# Altium schematic sheet LOGIC_MCU.SchDoc: MCU Logic
size B; Engineer: M. Jones; Organization: Michael Jones; DocumentNumber: 5; Revision: RA.1; SheetNumber: 5; SheetTotal: 7
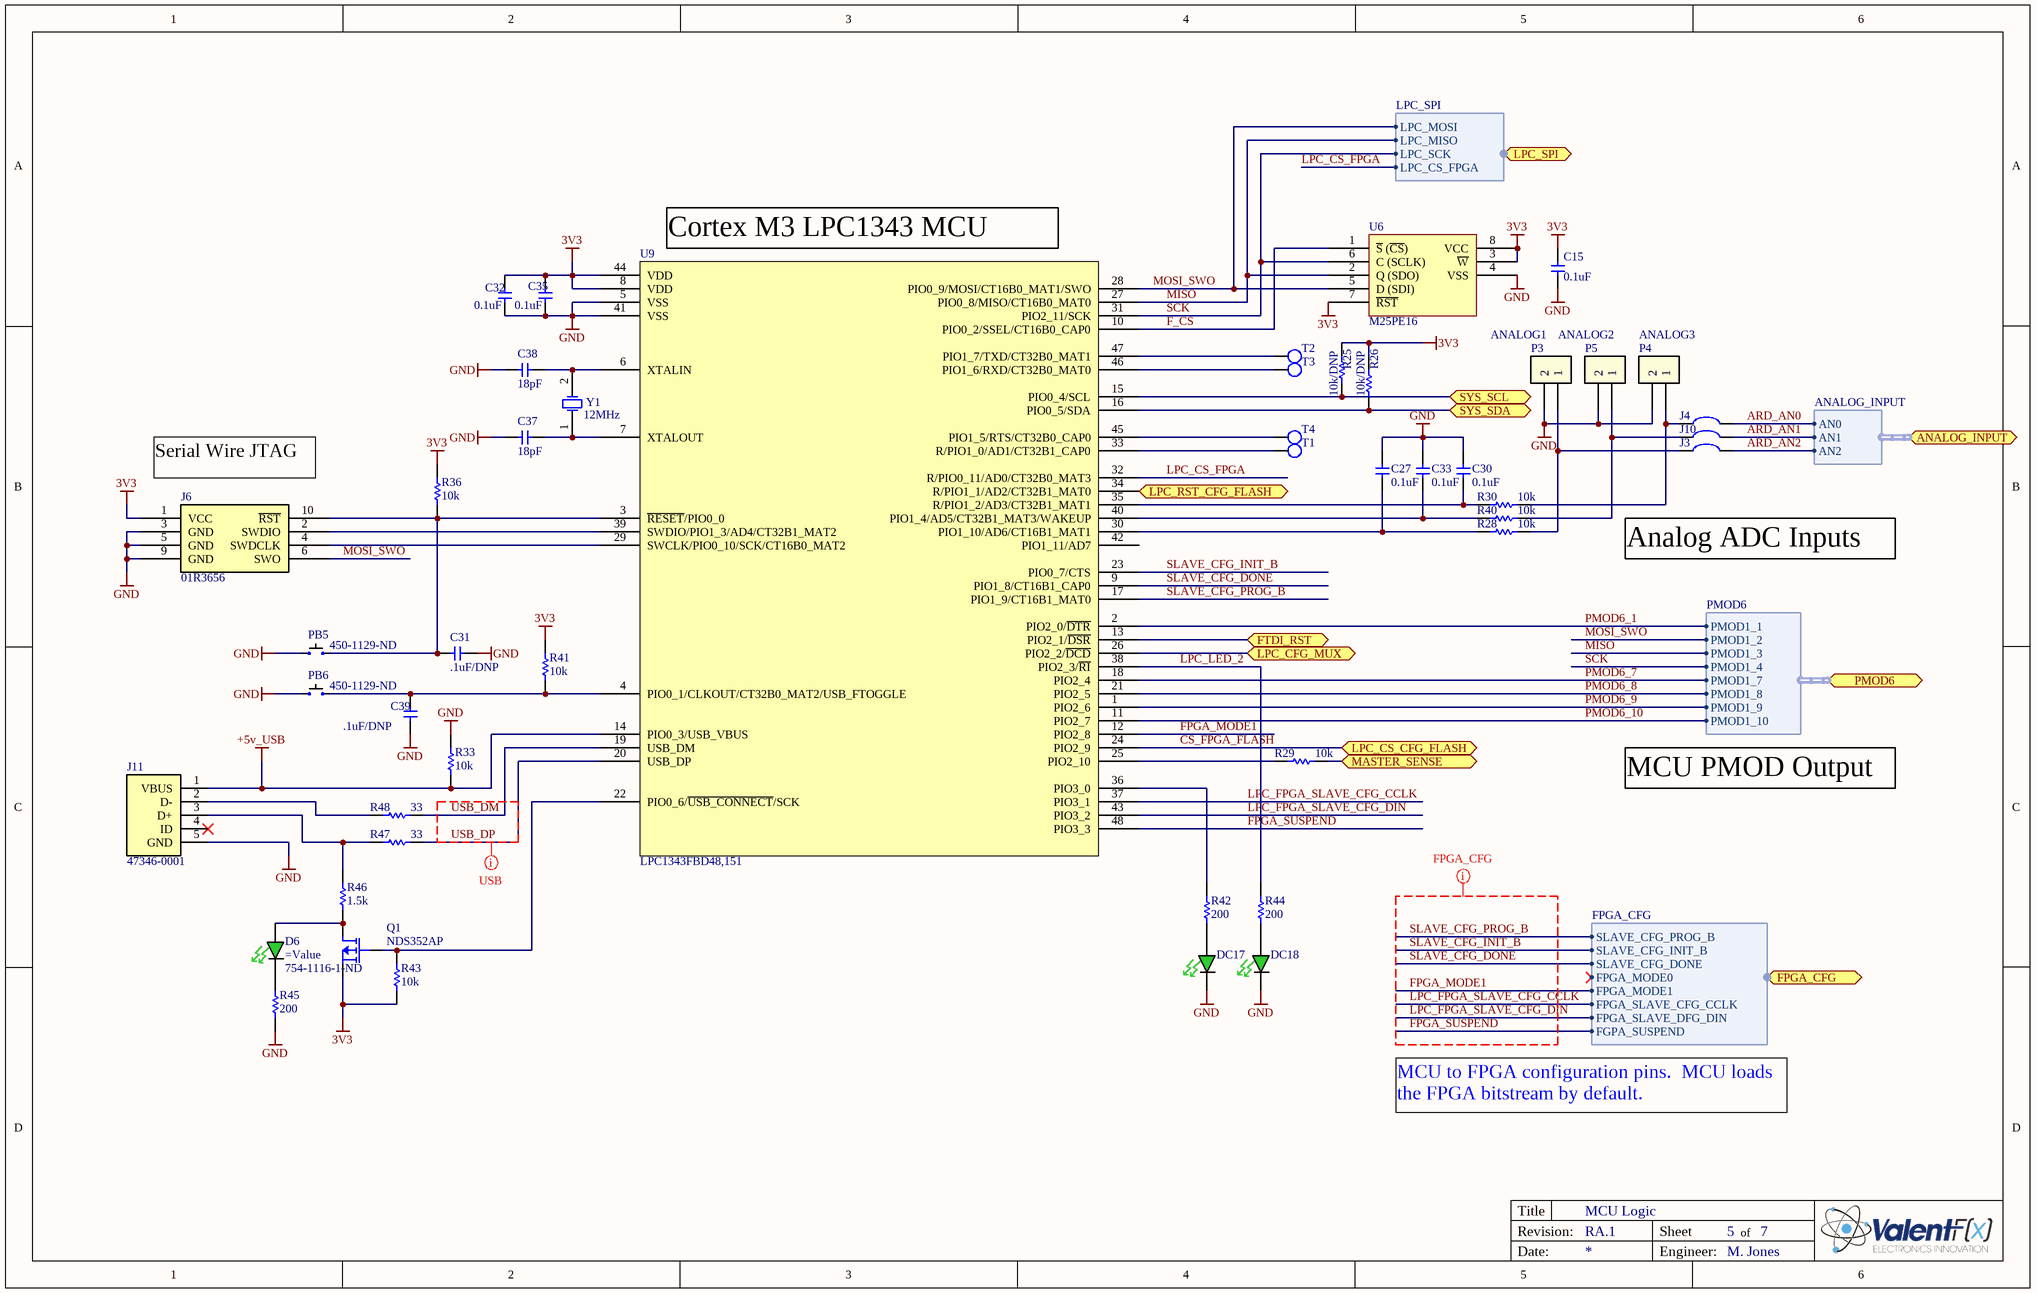
[diagram p0: LOGIC_MCU.SchDoc]

## Parts
C15  0.1uF  [C0603]
C27  0.1uF  [C0603]
C30  0.1uF  [C0603]
C31  .1uF/DNP  [C0603]
C32  0.1uF  [C0603]
C33  0.1uF  [C0603]
C35  0.1uF  [C0603]
C37  18pF  [C0603]
C38  18pF  [C0603]
C39  .1uF/DNP  [C0603]
D6  Supplier Part Number 1: 754-1116-1-ND  [LED_0603 - GREEN]
DC17  (no value)  [LED_0603 - GREEN]
DC18  (no value)  [LED_0603 - GREEN]
J3  Solder Jumper  [SOLDER_JUMPER SMALL 2]  (value not drawn)
J4  Solder Jumper  [SOLDER_JUMPER SMALL 2]  (value not drawn)
J6  01R3656  [FTSH-105-04-F-DV]
J10  Solder Jumper  [SOLDER_JUMPER SMALL 2]  (value not drawn)
J11  47346-0001  [USB - 47346-0001]
P3  ANALOG1  [HEADER_2_30_100 THRU SIP]
P4  ANALOG3  [HEADER_2_30_100 THRU SIP]
P5  ANALOG2  [HEADER_2_30_100 THRU SIP]
PB5  Supplier Part Number 1: 450-1129-ND  [FSM4JSMA]
PB6  Supplier Part Number 1: 450-1129-ND  [FSM4JSMA]
Q1  NDS352AP  [SOT-23]
R25  value 10k/DNP  [R0603]  (hidden comment: 10k)
R26  value 10k/DNP  [R0603]  (hidden comment: 10k)
R28  10k  [R0603]
R29  10k  [R0603]
R30  10k  [R0603]
R33  10k  [R0603]
R36  10k  [R0603]
R40  10k  [R0603]
R41  10k  [R0603]
R42  200  [R0603]
R43  10k  [R0603]
R44  200  [R0603]
R45  200  [R0603]
R46  1.5k  [R0603]
R47  33  [R0603]
R48  33  [R0603]
T1  Test Point  [tp 18-28]  (value not drawn)
T2  Test Point  [tp 18-28]  (value not drawn)
T3  Test Point  [tp 18-28]  (value not drawn)
T4  Test Point  [tp 18-28]  (value not drawn)
U6  M25PE16  [SOIC127P830X200-8L]
U9  LPC1343FBD48,151  [TSQFP50P900X900X145-48L]
Y1  12MHz  [ABM3]

## Ports
ANALOG_INPUT (harness ANALOG_INPUT), FPGA_CFG (harness FPGA_CFG), FTDI_RST, LPC_CFG_MUX, LPC_CS_CFG_FLASH, LPC_RST_CFG_FLASH, LPC_SPI (harness LPC_SPI), MASTER_SENSE, PMOD6 (harness PMOD6), SYS_SCL, SYS_SDA

## Harnesses
FPGA_CFG: SLAVE_CFG_PROG_B, SLAVE_CFG_INIT_B, SLAVE_CFG_DONE, FPGA_MODE0, FPGA_MODE1, FPGA_SLAVE_CFG_CCLK, FPGA_SLAVE_DFG_DIN, FGPA_SUSPEND
PMOD6: PMOD1_1, PMOD1_2, PMOD1_3, PMOD1_4, PMOD1_7, PMOD1_8, PMOD1_9, PMOD1_10
ANALOG_INPUT: AN0, AN1, AN2
LPC_SPI: LPC_MOSI, LPC_MISO, LPC_SCK, LPC_CS_FPGA

## Nets
3V3: C15.2 C32.2 C35.2 J6.1(VCC) Q1.2(S) R25.2 R26.2 R36.1 R41.1 R43.2 U6.3(~{W}) U6.7(~{RST}) U6.8(VCC) U9.8(VDD) U9.44(VDD)
+5v_USB: J11.1(VBUS) R33.2 U9.14(PIO0_3/USB_VBUS)
GND: C15.1 C27.2 C30.2 C31.1 C32.1 C33.2 C35.1 C37.1 C38.1 C39.1 DC17.C DC18.C J6.3(GND) J6.5(GND) J6.9(GND) J11.5(GND) P3.2 P4.2 P5.2 PB5.A PB6.A R33.1 R45.1 U6.4(VSS) U9.5(VSS) U9.41(VSS)
ARD_AN0: J4.2 ; port ANALOG_INPUT.AN0
ARD_AN1: J10.2 ; port ANALOG_INPUT.AN1
ARD_AN2: J3.2 ; port ANALOG_INPUT.AN2
CS_FPGA_FLASH: U9.24(PIO2_9) ; port LPC_CS_CFG_FLASH
F_CS: U6.1(~{S}_(~{CS})) U9.10(PIO0_2/SSEL/CT16B0_CAP0)
FPGA_MODE1: U9.12(PIO2_8) ; port FPGA_CFG.FPGA_MODE1
FPGA_SUSPEND: U9.48(PIO3_3) ; port FPGA_CFG.FGPA_SUSPEND
FTDI_RST: U9.13(PIO2_1/~{DSR}) ; port FTDI_RST
LPC_CFG_MUX: U9.26(PIO2_2/~{DCD}) ; port LPC_CFG_MUX
LPC_CS_FPGA: U9.32(R/PIO0_11/AD0/CT32B0_MAT3) ; port LPC_SPI.LPC_CS_FPGA
LPC_FPGA_SLAVE_CFG_CCLK: U9.37(PIO3_1) ; port FPGA_CFG.FPGA_SLAVE_CFG_CCLK
LPC_FPGA_SLAVE_CFG_DIN: U9.43(PIO3_2) ; port FPGA_CFG.FPGA_SLAVE_DFG_DIN
LPC_LED_2: R44.1 U9.38(PIO2_3/~{RI})
LPC_RST_CFG_FLASH: U9.34(R/PIO1_1/AD2/CT32B1_MAT0) ; port LPC_RST_CFG_FLASH
MASTER_SENSE: R29.2 ; port MASTER_SENSE
MISO: U6.2(Q_(SDO)) U9.27(PIO0_8/MISO/CT16B0_MAT0) ; port PMOD6.PMOD1_3, port LPC_SPI.LPC_MISO
MOSI_SWO: J6.6(SWO) U6.5(D_(SDI)) U9.28(PIO0_9/MOSI/CT16B0_MAT1/SWO) ; port PMOD6.PMOD1_2, port LPC_SPI.LPC_MOSI
PMOD6_1: U9.2(PIO2_0/~{DTR}) ; port PMOD6.PMOD1_1
PMOD6_7: U9.18(PIO2_4) ; port PMOD6.PMOD1_7
PMOD6_8: U9.21(PIO2_5) ; port PMOD6.PMOD1_8
PMOD6_9: U9.1(PIO2_6) ; port PMOD6.PMOD1_9
PMOD6_10: U9.11(PIO2_7) ; port PMOD6.PMOD1_10
SCK: U6.6(C_(SCLK)) U9.31(PIO2_11/SCK) ; port PMOD6.PMOD1_4, port LPC_SPI.LPC_SCK
SLAVE_CFG_DONE: U9.9(PIO1_8/CT16B1_CAP0) ; port FPGA_CFG.SLAVE_CFG_DONE
SLAVE_CFG_INIT_B: U9.23(PIO0_7/CTS) ; port FPGA_CFG.SLAVE_CFG_INIT_B
SLAVE_CFG_PROG_B: U9.17(PIO1_9/CT16B1_MAT0) ; port FPGA_CFG.SLAVE_CFG_PROG_B
SYS_SCL: R25.1 U9.15(PIO0_4/SCL) ; port SYS_SCL
SYS_SDA: R26.1 U9.16(PIO0_5/SDA) ; port SYS_SDA
USB_DM: R48.2 U9.19(USB_DM)
USB_DP: R47.2 U9.20(USB_DP)
NetC27_1: C27.1 R28.1 U9.30(PIO1_10/AD6/CT16B1_MAT1)
NetC30_1: C30.1 R30.1 U9.35(R/PIO1_2/AD3/CT32B1_MAT1)
NetC31_2: C31.2 J6.10(~{RST}) PB5.B R36.2 U9.3(~{RESET}/PIO0_0)
NetC33_1: C33.1 R40.1 U9.40(PIO1_4/AD5/CT32B1_MAT3/WAKEUP)
NetC37_2: C37.2 U9.7(XTALOUT) Y1.1(OSC1)
NetC38_2: C38.2 U9.6(XTALIN) Y1.2(OSC2)
NetC39_2: C39.2 PB6.B R41.2 U9.4(PIO0_1/CLKOUT/CT32B0_MAT2/USB_FTOGGLE)
NetD6_A: D6.A Q1.3(D) R46.1
NetD6_C: D6.C R45.2
NetDC17_A: DC17.A R42.2
NetDC18_A: DC18.A R44.2
NetJ3_1: J3.1 P3.1 R28.2
NetJ4_1: J4.1 P4.1 R30.2
NetJ6_2: J6.2(SWDIO) U9.39(SWDIO/PIO1_3/AD4/CT32B1_MAT2)
NetJ6_4: J6.4(SWDCLK) U9.29(SWCLK/PIO0_10/SCK/CT16B0_MAT2)
NetJ10_1: J10.1 P5.1 R40.2
NetJ11_2: J11.2(D-) R48.1
NetJ11_3: J11.3(D+) R46.2 R47.1
NetQ1_1: Q1.1(G) R43.1 U9.22(PIO0_6/~{USB_CON}~{NECT}/SCK)
NetR29_1: R29.1 U9.25(PIO2_10)
NetR42_1: R42.1 U9.36(PIO3_0)
NetT1_1: T1.1 U9.33(R/PIO1_0/AD1/CT32B1_CAP0)
NetT2_1: T2.1 U9.47(PIO1_7/TXD/CT32B0_MAT1)
NetT3_1: T3.1 U9.46(PIO1_6/RXD/CT32B0_MAT0)
NetT4_1: T4.1 U9.45(PIO1_5/RTS/CT32B0_CAP0)

Not connected (* = marked no-connect by the designer): J11 4(ID)*; U9 42(PIO1_11/AD7)

## Layout directives
net class FPGA_CFG: FPGA_MODE1, FPGA_SUSPEND, LPC_FPGA_SLAVE_CFG_CCLK, LPC_FPGA_SLAVE_CFG_DIN, SLAVE_CFG_DONE, SLAVE_CFG_INIT_B, SLAVE_CFG_PROG_B
net class USB: USB_DP

## Notes on the sheet
- (near U9) Cortex M3 LPC1343 MCU
- (near J6) Serial Wire JTAG
- Analog ADC Inputs
- MCU PMOD Output
- MCU to FPGA configuration pins.  MCU loads the FPGA bitstream by default.
- Title
- Revision:
- Sheet
- of
- Date:
- Engineer:

## Library data of the parts
C15 C27 C30 C32 C33 C35 = GRM188R71H104KA93D: CAP CER .1UF 50V 10% X7R 0603; Manufacturer: Murata Electronics North America; Capacitance: 0.1µF; Value: 0.1uF; Supplier 1: Digi-Key; Supplier Part Number 1: 490-1519-1-ND; Manufacturer Part Number: GRM188R71H104KA93D; RoHS: RoHS Compliant; Category: Capacitors; Stock 1: 6315460; Pricing 1: 10=0.037, 100=0.0221, 500=0.01276, 1000=0.00884 (USD); Voltage - Rated: 50V; Tolerance: ±10%; Temperature Coefficient: X7R; Mounting Type: Surface Mount, MLCC; Operating Temperature: -55°C ~ 125°C; Features: -; Applications: General Purpose; Ratings: -; Package / Case: 0603 (1608 Metric); Size / Dimension: 0.063" L x 0.031" W (1.60mm x 0.80mm); Lead Spacing: -; Thickness: 0.80mm; Packaging: Cut Tape (CT); Lead Style: -; ComponentLink1URL: http://search.murata.co.jp/Ceramy/image/img/PDF/ENG/GRM188R71H104KA93.pdf; ComponentLink1Description: http://search.murata.co.jp/Ceramy/image/img/PDF/ENG/GRM188R71H104KA93.pdf
C31 C39 = GRM188R71H104KA93D: CAP CER .1UF 50V 10% X7R 0603; Manufacturer: Murata Electronics North America; Value: 0.1uF; Capacitance: 0.1µF; Supplier 1: Digi-Key; Supplier Part Number 1: 490-1519-1-ND; Manufacturer Part Number: GRM188R71H104KA93D; RoHS: RoHS Compliant; Category: Capacitors; Stock 1: 6315460; Pricing 1: 10=0.037, 100=0.0221, 500=0.01276, 1000=0.00884 (USD); Voltage - Rated: 50V; Tolerance: ±10%; Temperature Coefficient: X7R; Mounting Type: Surface Mount, MLCC; Operating Temperature: -55°C ~ 125°C; Features: -; Applications: General Purpose; Ratings: -; Package / Case: 0603 (1608 Metric); Size / Dimension: 0.063" L x 0.031" W (1.60mm x 0.80mm); Lead Spacing: -; Thickness: 0.80mm; Packaging: Cut Tape (CT); Lead Style: -; ComponentLink1URL: http://search.murata.co.jp/Ceramy/image/img/PDF/ENG/GRM188R71H104KA93.pdf; ComponentLink1Description: http://search.murata.co.jp/Ceramy/image/img/PDF/ENG/GRM188R71H104KA93.pdf
C37 C38 = GRM1885C1H180JA01D: CAP CER 18PF 50V 5% C0G 0603; Source Part Number: 490-1409-1-ND; Manufacturer: Murata Electronics North America; Temperature Coefficient: C0G, NP0; Source: Digikey; Manufacturer Part Number: GRM1885C1H180JA01D; ROHS Certificate: *; Value: CAP CER 18PF 50V 5% C0G 0603; Supplier 1: Digi-Key; Supplier Part Number 1: 490-1409-1-ND; RoHS: RoHS Compliant; Category: Capacitors; Stock 1: 357140; Pricing 1: 10=0.037, 100=0.0221, 500=0.01276, 1000=0.00884 (USD); Capacitance: 18pF; Voltage - Rated: 50V; Tolerance: ±5%; Mounting Type: Surface Mount, MLCC; Operating Temperature: -55°C ~ 125°C; Features: -; Applications: General Purpose; Ratings: -; Package / Case: 0603 (1608 Metric); Size / Dimension: 0.063" L x 0.031" W (1.60mm x 0.80mm); Lead Spacing: -; Thickness: 0.80mm; Packaging: Cut Tape (CT); Lead Style: -; ComponentLink1URL: http://search.murata.co.jp/Ceramy/image/img/PDF/ENG/GRM1885C1H180JA01.pdf; ComponentLink1Description: http://search.murata.co.jp/Ceramy/image/img/PDF/ENG/GRM1885C1H180JA01.pdf
D6 = APT1608CGCK: LED 1.6X0.8MM 570NM GRN CLR SMD; Manufacturer: Kingbright Corp; Color: Green; Current - Test: 20mA; Wavelength - Peak: 574nm; Millicandela Rating: 50mcd; Voltage - Forward (Vf) Typ: 2.1V; Lens Type: Clear; Lens Style/Size: Rectangle with Flat Top, 1.2mm x 0.8mm; Viewing Angle: 120°; Supplier 1: Digi-Key; Manufacturer Part Number: APT1608CGCK; RoHS: RoHS Compliant; Category: Optoelectronics; Stock 1: 98122; Pricing 1: 1=0.2, 10=0.153, 25=0.1224, 100=0.1105, 250=0.102, 500=0.0918 (USD); Luminous Flux @ Current - Test: -; Wavelength - Dominant: 570nm; Size / Dimension: 1.60mm L x 0.80mm W; Height: 0.75mm; Package / Case: 0603 (1608 Metric); Mounting Type: Surface Mount; Packaging: Cut Tape (CT); ComponentLink1URL: http://www.us.kingbright.com/images/catalog/SPEC/APT1608CGCK.pdf; ComponentLink1Description: http://www.us.kingbright.com/images/catalog/SPEC/APT1608CGCK.pdf
DC17 DC18 = APT1608CGCK: LED 1.6X0.8MM 570NM GRN CLR SMD; Manufacturer: Kingbright Corp; Current - Test: 20mA; Wavelength - Peak: 574nm; Millicandela Rating: 50mcd; Voltage - Forward (Vf) Typ: 2.1V; Lens Type: Clear; Lens Style/Size: Rectangle with Flat Top, 1.2mm x 0.8mm; Viewing Angle: 120°; Supplier 1: Digi-Key; Supplier Part Number 1: 754-1116-1-ND; Manufacturer Part Number: APT1608CGCK; RoHS: RoHS Compliant; Category: Optoelectronics; Stock 1: 98122; Pricing 1: 1=0.2, 10=0.153, 25=0.1224, 100=0.1105, 250=0.102, 500=0.0918 (USD); Color: Green; Luminous Flux @ Current - Test: -; Wavelength - Dominant: 570nm; Size / Dimension: 1.60mm L x 0.80mm W; Height: 0.75mm; Package / Case: 0603 (1608 Metric); Mounting Type: Surface Mount; Packaging: Cut Tape (CT); ComponentLink1URL: http://www.us.kingbright.com/images/catalog/SPEC/APT1608CGCK.pdf; ComponentLink1Description: http://www.us.kingbright.com/images/catalog/SPEC/APT1608CGCK.pdf
J3 J4 J10 = Solder Jumper: Solder/Configuration Jumper; Manufacturer: n/a; Manufacturer Part Number: n/a; Source: n/a; Source Part Number: n/a; ROHS Certificate: n/a
J6 = Cortex SWD  Connector: Cortex SWD Connector; Manufacturer: SAMTEC; Description: SAMTEC - FTSH-105-04-F-DV - .050 X .050; Supplier 1: Newark; Supplier Part Number 1: 01R3656; Manufacturer Part Number: FTSH-105-04-F-DV; Category: Connectors; Stock 1: 0; Pricing 1: 1=0.871, 25000=0.754, 50000=0.705 (USD); Value: 01R3656
J11 = USB - 0473460001: Micro B CONN RCPT 5POS MICRO B USB R/A; Manufacturer: Molex Inc; Description: CONN RCPT 5POS MICRO USB R/A; Connector Type: USB - micro B; Number of Contacts: 5; Gender: Receptacle; Supplier 1: Digi-Key; Manufacturer Part Number: 0473460001; RoHS: RoHS Compliant; Category: Connectors, Interconnects; Stock 1: 2501; Pricing 1: 1=1, 10=0.877, 25=0.8252, 50=0.7906, 100=0.7563, 250=0.68752, 500=0.61876, 1000=0.55 (USD); Specifications: -; Mounting Type: Surface Mount, Right Angle, Horizontal; Features: Shielded; Packaging: Cut Tape (CT); Ingress Protection: -; ComponentLink1URL: http://www.molex.com/pdm_docs/sd/473460001_sd.pdf; ComponentLink1Description: http://www.molex.com/pdm_docs/sd/473460001_sd.pdf; Supplier Part Number 1: WM17141CT-ND; Value: 47346-0001
P3-P5 = Header2: Header 2 pin
PB5 PB6 = FSM4JSMATR: SWITCH TACTILE SPST-NO 0.05A 12V; Manufacturer: TE Connectivity; Switch Function: Off-Mom; Contact Rating @ Voltage: 0.05A @ 12VDC; Actuator Type: Standard; Outline: 6.00mm x 6.00mm; Illumination: Non-Illuminated; Operating Force: 160gf; Actuator Height off PCB, from Pins: 5.00mm; Actuator Orientation: Top Actuated; Actuator Material: Polyphenylene Sulfide (PPS); Switch Travel: 0.25mm; Mechanical Life: 100,000 Cycles; Supplier 1: Digi-Key; Manufacturer Part Number: FSM4JSMA; RoHS: RoHS Compliant; Category: Switches; Stock 1: 13038; Pricing 1: 1=0.26, 10=0.246, 25=0.2096, 50=0.1834, 100=0.1703, 250=0.15064, 500=0.1441, 1000=0.1179, 5000=0.09825 (USD); Circuit: SPST-NO; Mounting Type: Surface Mount; Termination Style: Gull Wing; Packaging: Bulk; ComponentLink1URL: http://www.te.com/commerce/DocumentDelivery/DDEController?Action=srchrtrv&DocNm=2-1437565-7&DocType=Customer+Drawing&DocLang=English; ComponentLink1Description: http://www.te.com/commerce/DocumentDelivery/DDEController?Action=srchrtrv&DocNm=2-1437565-7&DocType=Customer+Drawing&DocLang=English; Illumination Voltage (Nominal): -; Illumination Type, Color: -; Ingress Protection: -; Features: -; Operating Temperature: -35°C ~ 85°C
Q1 = NDS352AP: MOSFET P-CH 30V 900MA SSOT3; Manufacturer: Fairchild Semiconductor; FET Type: MOSFET P-Channel, Metal Oxide; FET Feature: Logic Level Gate; Rds On (Max) @ Id, Vgs: 300 mOhm @ 1A, 10V; Vgs(th) (Max) @ Id: 2.5V @ 250µA; Gate Charge (Qg) @ Vgs: 3nC @ 4.5V; Input Capacitance (Ciss) @ Vds: 135pF @ 15V; Power - Max: 460mW; Value: NDS352AP; Supplier 1: Digi-Key; Supplier Part Number 1: NDS352APCT-ND; Manufacturer Part Number: NDS352AP; RoHS: RoHS Compliant; Category: Discrete Semiconductor Products; Stock 1: 165125; Pricing 1: 1=0.61, 10=0.485, 100=0.364, 250=0.31436, 500=0.27024, 750=0.23163, 1000=0.20957, 2000=0.19303 (USD); Drain to Source Voltage (Vdss): 30V; Current - Continuous Drain (Id) @ 25° C: 900mA; Mounting Type: Surface Mount; Package / Case: TO-236-3, SC-59, SOT-23-3; Packaging: Cut Tape (CT); Supplier Device Package: 3-SSOT; ComponentLink1URL: http://media.digikey.com/pdf/Data%20Sheets/Fairchild%20PDFs/NDS352AP.pdf; ComponentLink1Description: http://media.digikey.com/pdf/Data%20Sheets/Fairchild%20PDFs/NDS352AP.pdf
R25 R26 R28-R30 R33 R36 R40 R41 R43 = ERJ-3EKF1002V: RES 10.0K OHM 1/10W 1% 0603 SMD; Source Part Number: P10.0KHCT-ND; Manufacturer: Panasonic - ECG; Power (Watts): 0.1W, 1/10W; Temperature Coefficient: ±100ppm/°C; Source: Digikey; ROHS Certificate: *; RoHS: RoHS Compliant; Category: Resistors; Resistance In Ohms: 10.0K; Composition: Thick Film; Features: -; Tolerance: ±1%; Case: 0603 (1608 metric); Size / Dimension: 0.063" L x 0.031" W (1.60mm x 0.80mm); Height: 0.018" (0.45mm); Lead Style: Surface Mount (SMD - SMT); Packaging: Cut Tape (CT); ComponentLink1URL: http://industrial.panasonic.com/www-cgi/jvcr13pz.cgi?E+PZ+3+AOA0002+ERJ3EKF1002V+7+WW; ComponentLink1Description: http://industrial.panasonic.com/www-cgi/jvcr13pz.cgi?E+PZ+3+AOA0002+ERJ3EKF1002V+7+WW; Manufacturer Part Number: ERJ-3EKF1002V; Supplier 1: Digi-Key; Stock 1: 10570746; Pricing 1: 1=0.04, 50=0.015, 100=0.0114, 250=0.00844, 500=0.00624, 1000=0.00416 (USD); Supplier Part Number 1: P10.0KHCT-ND
  R28-R30 R33 R36 R40 R41 R43: Value: 10k
R42 R44 R45 = ERJ-3EKF2000V: RES 200 OHM 1/10W 1% 0603 SMD; Manufacturer: Panasonic - ECG; Power (Watts): 0.1W, 1/10W; Temperature Coefficient: ±100ppm/°C; Manufacturer Part Number: ERJ-3EKF2000V; Value: RES 200 OHM 1/10W 1% 0603 SMD; Supplier 1: Digi-Key; Supplier Part Number 1: P200HCT-ND; RoHS: RoHS Compliant; Category: Resistors; Stock 1: 1279595; Pricing 1: 1=0.04, 50=0.015, 100=0.0114, 250=0.00844, 500=0.00624, 1000=0.00416 (USD); Resistance (Ohms): 200; Composition: Thick Film; Features: -; Tolerance: ±1%; Size / Dimension: 0.063" L x 0.031" W (1.60mm x 0.80mm); Height: 0.018" (0.45mm); Lead Style: Surface Mount (SMD - SMT); Packaging: Cut Tape (CT); Package / Case: 0603 (1608 Metric); ComponentLink1URL: http://industrial.panasonic.com/www-cgi/jvcr13pz.cgi?E+PZ+3+AOA0002+ERJ3EKF2000V+7+WW; ComponentLink1Description: http://industrial.panasonic.com/www-cgi/jvcr13pz.cgi?E+PZ+3+AOA0002+ERJ3EKF2000V+7+WW
R46 = ERJ-3EKF1501V: RES 1.50K OHM 1/10W 1% 0603 SMD; Manufacturer: Panasonic - ECG; Power (Watts): 0.1W, 1/10W; Temperature Coefficient: ±100ppm/°C; Value: 1.5k; Supplier 1: Digi-Key; Supplier Part Number 1: P1.50KHCT-ND; Manufacturer Part Number: ERJ-3EKF1501V; RoHS: RoHS Compliant; Category: Resistors; Stock 1: 1714688; Pricing 1: 1=0.04, 50=0.015, 100=0.0114, 250=0.00844, 500=0.00624, 1000=0.00416 (USD); Resistance (Ohms): 1.50K; Composition: Thick Film; Features: -; Tolerance: ±1%; Size / Dimension: 0.063" L x 0.031" W (1.60mm x 0.80mm); Height: 0.018" (0.45mm); Lead Style: Surface Mount (SMD - SMT); Packaging: Cut Tape (CT); Package / Case: 0603 (1608 Metric); ComponentLink1URL: http://industrial.panasonic.com/www-cgi/jvcr13pz.cgi?E+PZ+3+AOA0002+ERJ3EKF1501V+7+WW; ComponentLink1Description: http://industrial.panasonic.com/www-cgi/jvcr13pz.cgi?E+PZ+3+AOA0002+ERJ3EKF1501V+7+WW
R47 R48 = ERJ-3EKF33R0V: RES 33.0 OHM 1/10W 1% 0603 SMD; Manufacturer: Panasonic - ECG; Resistance (Ohms): 33.0; Power (Watts): 0.1W, 1/10W; Temperature Coefficient: ±100ppm/°C; Value: 33; Supplier 1: Digi-Key; Supplier Part Number 1: P33.0HCT-ND; Manufacturer Part Number: ERJ-3EKF33R0V; RoHS: RoHS Compliant; Category: Resistors; Stock 1: 247775; Pricing 1: 1=0.04, 50=0.015, 100=0.0114, 250=0.00844, 500=0.00624, 1000=0.00416 (USD); Composition: Thick Film; Features: -; Tolerance: ±1%; Size / Dimension: 0.063" L x 0.031" W (1.60mm x 0.80mm); Height: 0.018" (0.45mm); Lead Style: Surface Mount (SMD - SMT); Packaging: Cut Tape (CT); Package / Case: 0603 (1608 Metric); ComponentLink1URL: http://industrial.panasonic.com/www-cgi/jvcr13pz.cgi?E+PZ+3+AOA0002+ERJ3EKF33R0V+7+WW; ComponentLink1Description: http://industrial.panasonic.com/www-cgi/jvcr13pz.cgi?E+PZ+3+AOA0002+ERJ3EKF33R0V+7+WW
T1-T4 = Test Point 2: Test Point Smaller Symbol
U6 = M25PE16-VMW6TG: IC FLASH 16MBIT 75MHZ 8SOIC; Manufacturer: Numonyx/ST Micro; Memory Size: 16M (2M x 8); Interface: SPI, 3-Wire Serial; Voltage - Supply: 2.7 V ~ 3.6 V; Supplier 1: Digi-Key; Manufacturer Part Number: M25PE16-VMW6TG; RoHS: RoHS Compliant; Category: Integrated Circuits (ICs); Stock 1: 866; Pricing 1: 1=2.31, 10=1.98, 25=1.782, 100=1.617, 250=1.452, 500=1.254 (USD); Format - Memory: FLASH; Memory Type: FLASH; Speed: 75MHz; Operating Temperature: -40°C ~ 85°C; Package / Case: 8-SOIC (0.200", 5.30mm Width); Packaging: Cut Tape (CT); Supplier Device Package: *; ComponentLink1URL: http://www.numonyx.com/Documents/Datasheets/M25PE16.pdf; ComponentLink1Description: http://www.numonyx.com/Documents/Datasheets/M25PE16.pdf; Supplier Part Number 1: M25PE16-VMW6TGCT-ND; Value: M25PE16
U9 = LPC1343FBD48,151: IC MCU 32BIT 32KB FLASH 48LQFP; Manufacturer: NXP Semiconductors; Core Processor: ARM® Cortex-M3™; Core Size: 32-Bit; Speed: 72MHz; Connectivity: I²C, Microwire, SPI, SSI, SSP, UART/USART, USB; Peripherals: Brown-out Detect/Reset, POR, WDT; Number of I /O: 40; Program Memory Size: 32KB (32K x 8); RAM Size: 8K x 8; Voltage - Supply (Vcc/Vdd): 2 V ~ 3.6 V; Data Converters: A/D 8x10b; Oscillator Type: Internal; Value: LPC1343FBD48,151; Supplier 1: Digi-Key; Supplier Part Number 1: 568-4945-ND; Manufacturer Part Number: LPC1343FBD48,151; RoHS: RoHS Compliant; Category: Integrated Circuits (ICs); Stock 1: 734; Pricing 1: 1=6.3, 25=5.0624, 100=4.6125, 250=4.16252, 500=3.735, 1000=3.15, 2500=2.9925, 5000=2.86875 (USD); Program Memory Type: FLASH; EEPROM Size: -; Operating Temperature: -40°C ~ 85°C; Package / Case: 48-LQFP; Packaging: Tray; ComponentLink1URL: http://ics.nxp.com/products/lpc1000/datasheet/lpc1311.lpc1313.lpc1342.lpc1343.pdf; ComponentLink1Description: http://ics.nxp.com/products/lpc1000/datasheet/lpc1311.lpc1313.lpc1342.lpc1343.pdf
Y1 = ABM3-12.000MHZ-B2-T: CRYSTAL 12.000MHZ 18PF SMD; Manufacturer: Abracon Corporation; Frequency Stability: ±50ppm; Frequency Tolerance: ±20ppm; Operating Mode: Fundamental; Supplier 1: Digi-Key; Manufacturer Part Number: ABM3-12.000MHZ-B2-T; RoHS: RoHS Compliant; Category: Crystals and Oscillators; Stock 1: 22557; Pricing 1: 1=1.88, 10=1.625, 50=1.425, 100=1.125, 500=0.95 (USD); Type: MHz Crystal; Frequency: 12MHz; Load Capacitance: 18pF; Operating Temperature: -20°C ~ 70°C; Mounting Type: Surface Mount; Package / Case: 2-SMD, No Lead (DFN, LCC); Size / Dimension: 0.197" L x 0.126" W (5.00mm x 3.20mm); Height: 0.051" (1.30mm); Packaging: Cut Tape (CT); ComponentLink1URL: http://www.abracon.com/Resonators/abm3.pdf; ComponentLink1Description: http://www.abracon.com/Resonators/abm3.pdf; Supplier Part Number 1: 535-9100-1-ND; Value: 12MHz